# EasyEDA schematic 1-Schematic_Esp12F.json
TITLE: Sheet_1; REV: 1.0; Date: 2024-03-21; Sheet: 1/1; Drawn By: kollarapranav; Company: Your Company
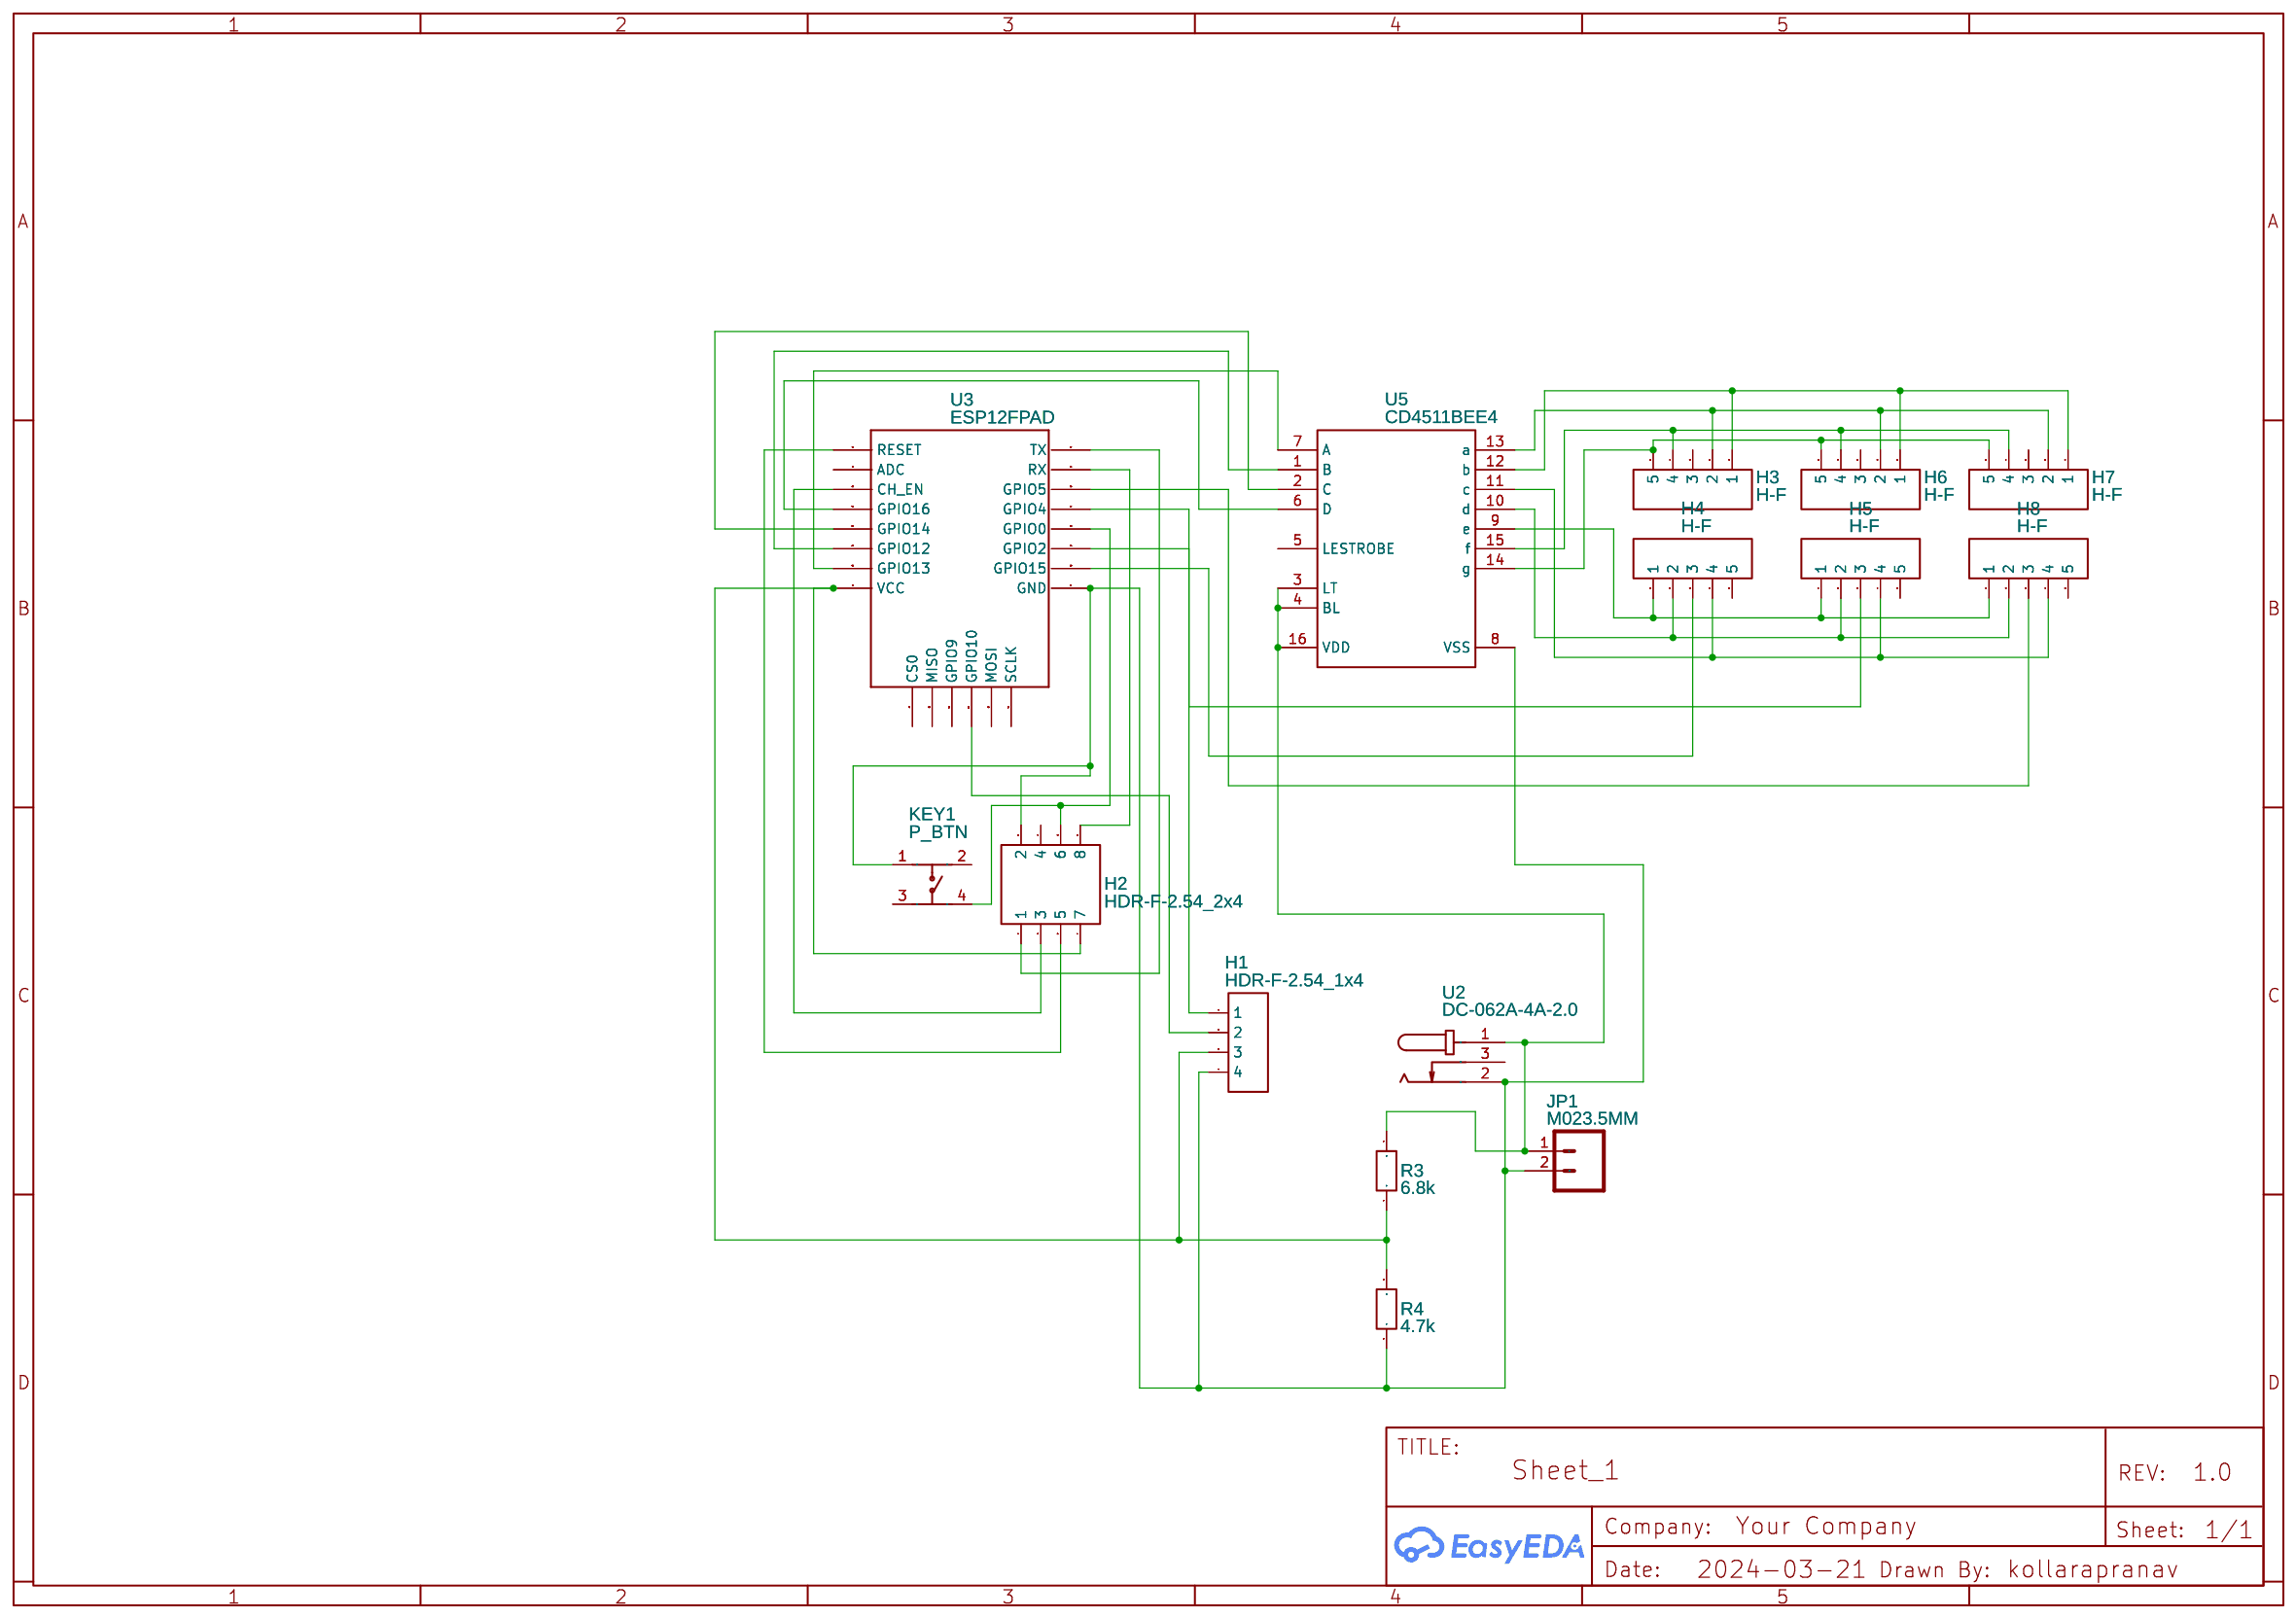
[diagram p0: schematic sheet]

## Parts
H1  HDR-F-2.54_1x4  [HDR-F-2.54_1X4]
H2  HDR-F-2.54_2x4  [HDR-F-2.54_2X4]
H3  H-F  [HDR-F-2.54_1X5]
H4  H-F  [HDR-F-2.54_1X5]
H5  H-F  [HDR-F-2.54_1X5]
H6  H-F  [HDR-F-2.54_1X5]
H7  H-F  [HDR-F-2.54_1X5]
H8  H-F  [HDR-F-2.54_1X5]
JP1  M023.5MM  [SCREWTERMINAL-3.5MM-2]
KEY1  P_BTN  [SW-SMD_4P-L6.0-W6.0-P4.50-LS10.0_TL3301EF160QG]
R3  6.8k  [AXIAL-0.4]
R4  4.7k  [AXIAL-0.4]
U2  DC-062A-4A-2.0  [DC-IN-TH_XKB_DC-062A-4A-2.0]
U3  ESP12FPAD  [ESP12F]
U5  CD4511BEE4  [DIP16]

## Library data of the parts
H1 = HDR-F-2.54_1x4: Supplier Part: C225501; Supplier: LCSC; Contributor: LCEDA_Lib
H2 = HDR-F-2.54_2x4: Supplier Part: C239344; Supplier: LCSC; Contributor: LCEDA_Lib
H3-H8 = HDR-F-2.54_1x5: Supplier Part: C50950; Supplier: LCSC; Contributor: LCEDA_Lib
JP1 = M023.5MM: Standard 2-pin 0.1 header. Use with; Contributor: SparkFun
KEY1 = 4PINTACTPCBTHTPUSHBUTTON: Contributor: LCSC; Supplier: LCSC; Supplier Part: C9900003768; Manufacturer: null; Manufacturer Part: 4pinTACTPCBTHTPushButton; JLCPCB Part Class: Extended Part
R3 R4 = Res_AXIAL-0.4(1/4W)_EU
U2 = DC-062A-4A-2.0: Contributor: lcsc; Supplier: LCSC; Supplier Part: C5147479; Manufacturer: XKB Connection(中国星坤); JLCPCB Part Class: Extended Part
U3 = ESP12FPAD: Contributor: corentindedicast
U5 = CD4511BEE4: CMOS BCD-to-7-Segment LED Latch  Decoder  Driver, 3 to 18 V, -55 to 125 degC, 16-pin DIP (N16), Pb-Free (RoHS)

## Nets
Net-(H1-1): H1.1 U3.GPIO4
Net-(H1-2): H1.2 U3.GPIO10
Net-(H1-3): H1.3 H2.7 R3.1 R4.2 U3.VCC
Net-(H1-4): H1.4 H2.2 JP1.2 KEY1.1 R4.1 U2.2 U3.GND U5.8(VSS)
Net-(H2-1): H2.1 U3.TXD0(TX)
Net-(H2-3): H2.3 U3.CH_PD(CH_EN)
Net-(H2-5): H2.5 U3.RESET
Net-(H2-6): H2.6 KEY1.4 U3.GPIO0
Net-(H2-8): H2.8 U3.RXD0(RX)
Net-(H3-1): H3.1 H6.1 H7.1 U5.12(b)
Net-(H3-2): H3.2 H6.2 H7.2 U5.13(a)
Net-(H3-4): H3.4 H6.4 H7.4 U5.15(f)
Net-(H3-5): H3.5 H6.5 H7.5 U5.14(g)
Net-(H4-1): H4.1 H5.1 H8.1 U5.9(e)
Net-(H4-2): H4.2 H5.2 H8.2 U5.10(d)
Net-(H4-3): H4.3 U3.GPIO15
Net-(H4-4): H4.4 H5.4 H8.4 U5.11(c)
Net-(H5-3): H5.3 U3.GPIO2
Net-(H8-3): H8.3 U3.GPIO5
Net-(JP1-1): JP1.1 R3.2 U2.1 U5.3(LT) U5.4(BL) U5.16(VDD)
Net-(U3-GPIO12): U3.GPIO12 U5.1(B)
Net-(U3-GPIO13): U3.GPIO13 U5.7(A)
Net-(U3-GPIO14): U3.GPIO14 U5.2(C)
Net-(U3-GPIO16): U3.GPIO16 U5.6(D)

Not connected (* = marked no-connect by the designer): H2 4; H3 3; H4 5; H5 5; H6 3; H7 3; H8 5; KEY1 2 3; U2 3; U3 ADC CS0 GPIO9 MISO MOSI SCLK; U5 5(LESTROBE)
